# Altium project mppt.PrjPCB
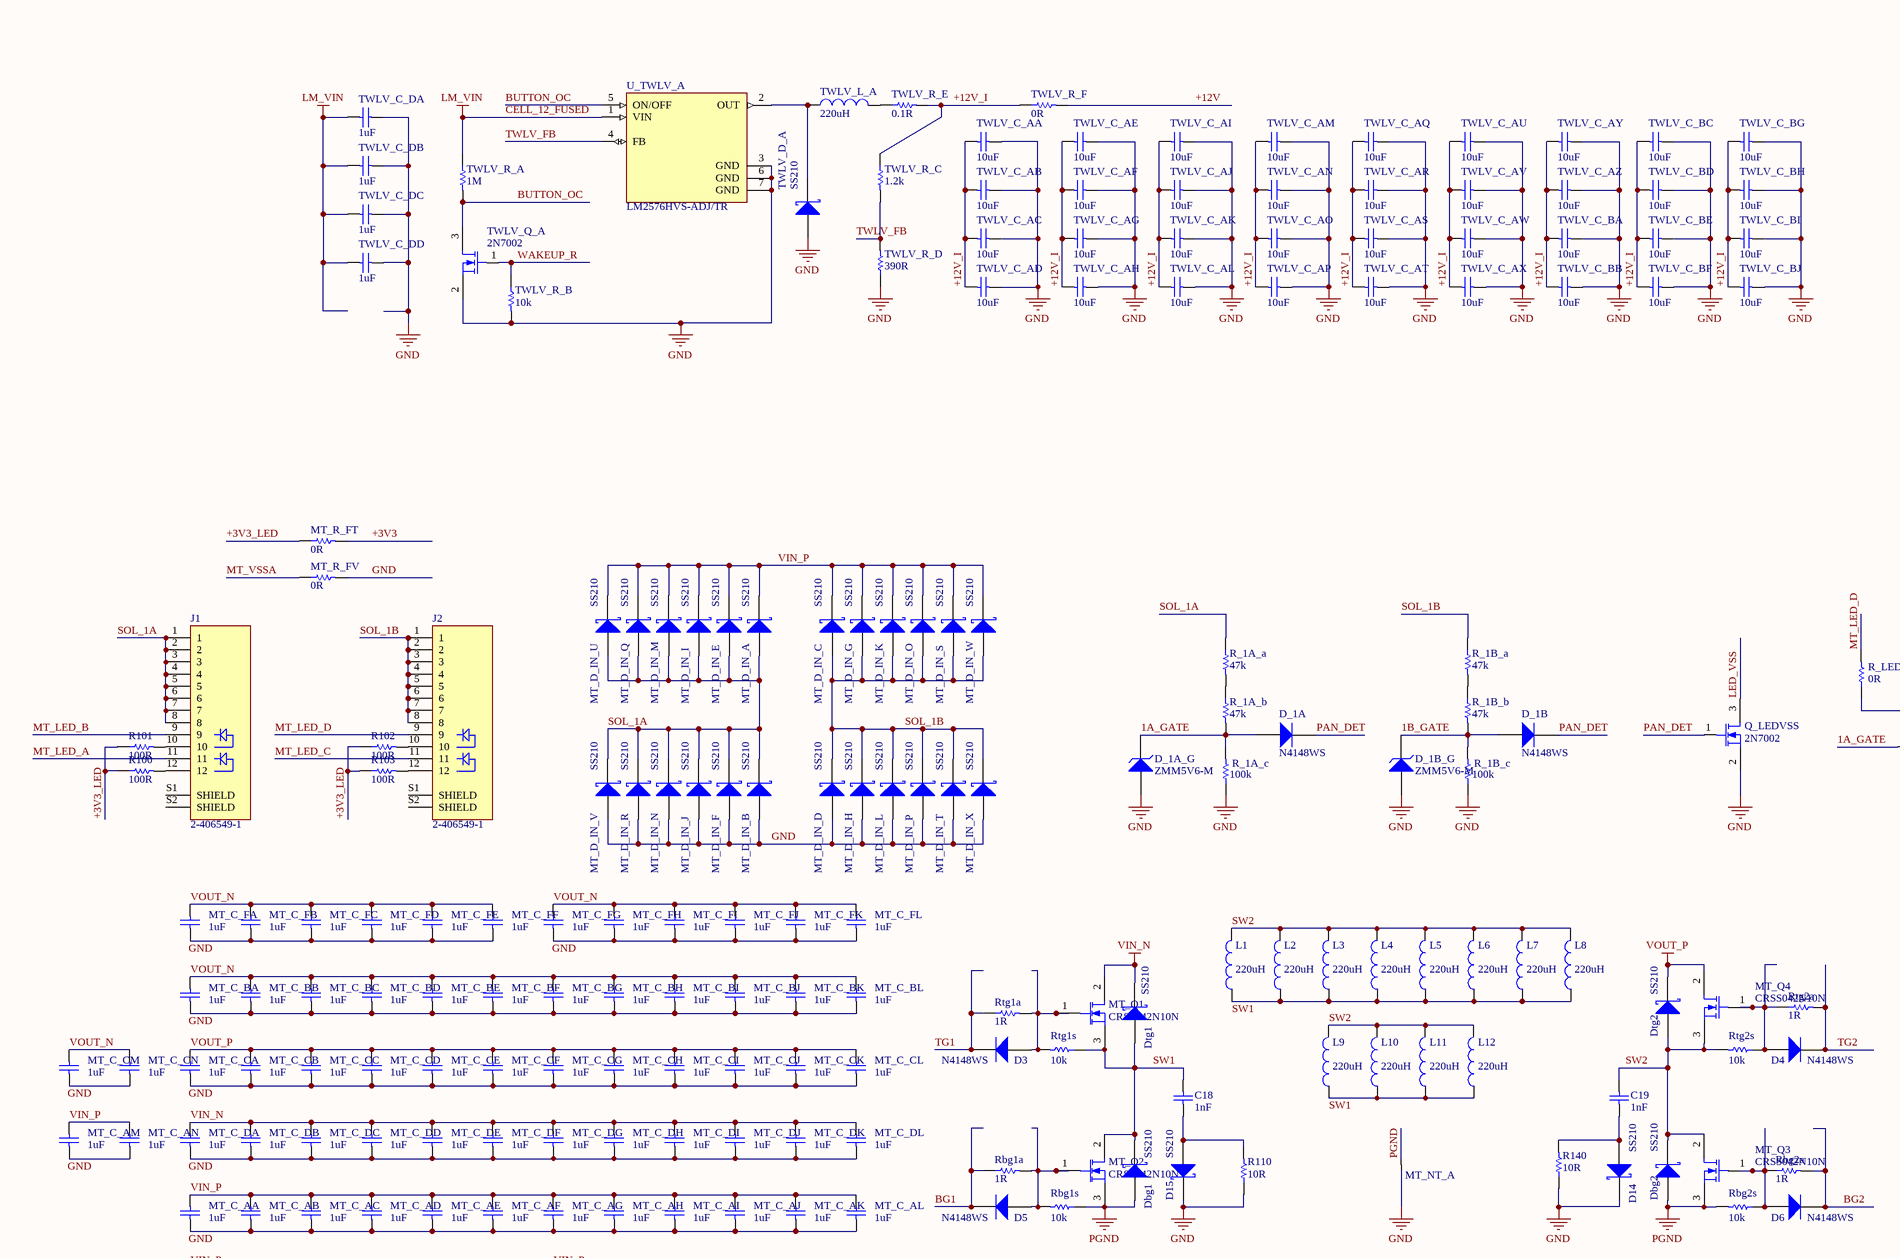
[diagram p0: mppt.SchDoc, top left]
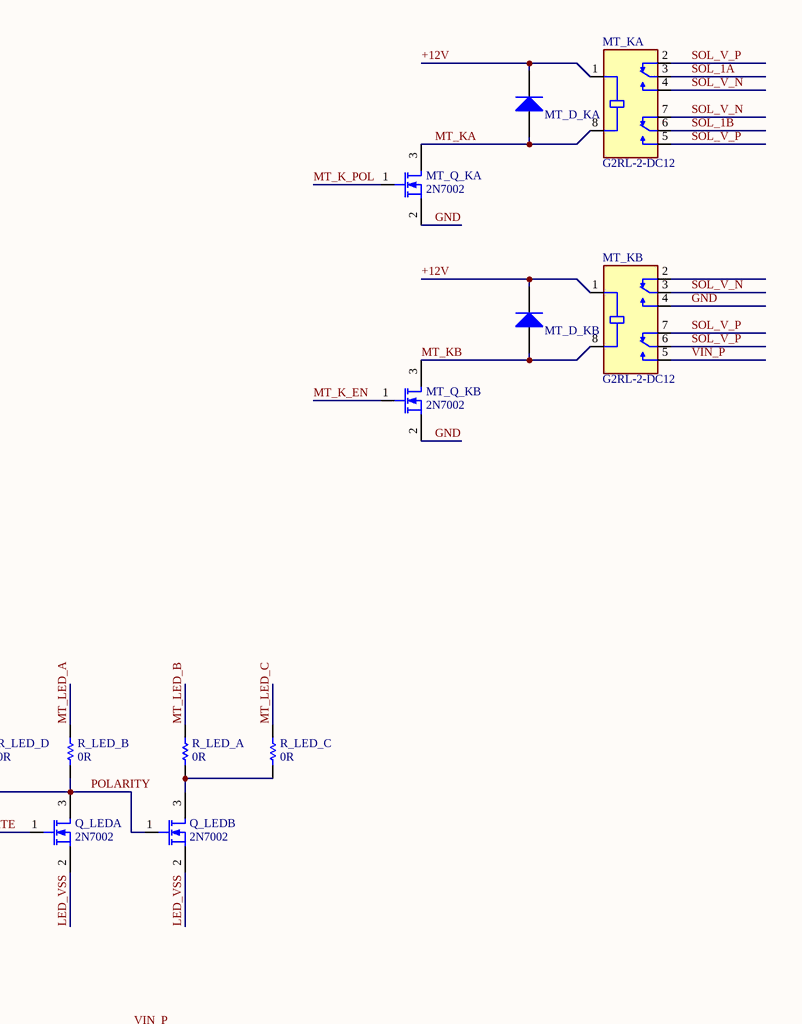
[diagram p1: mppt.SchDoc, top right]
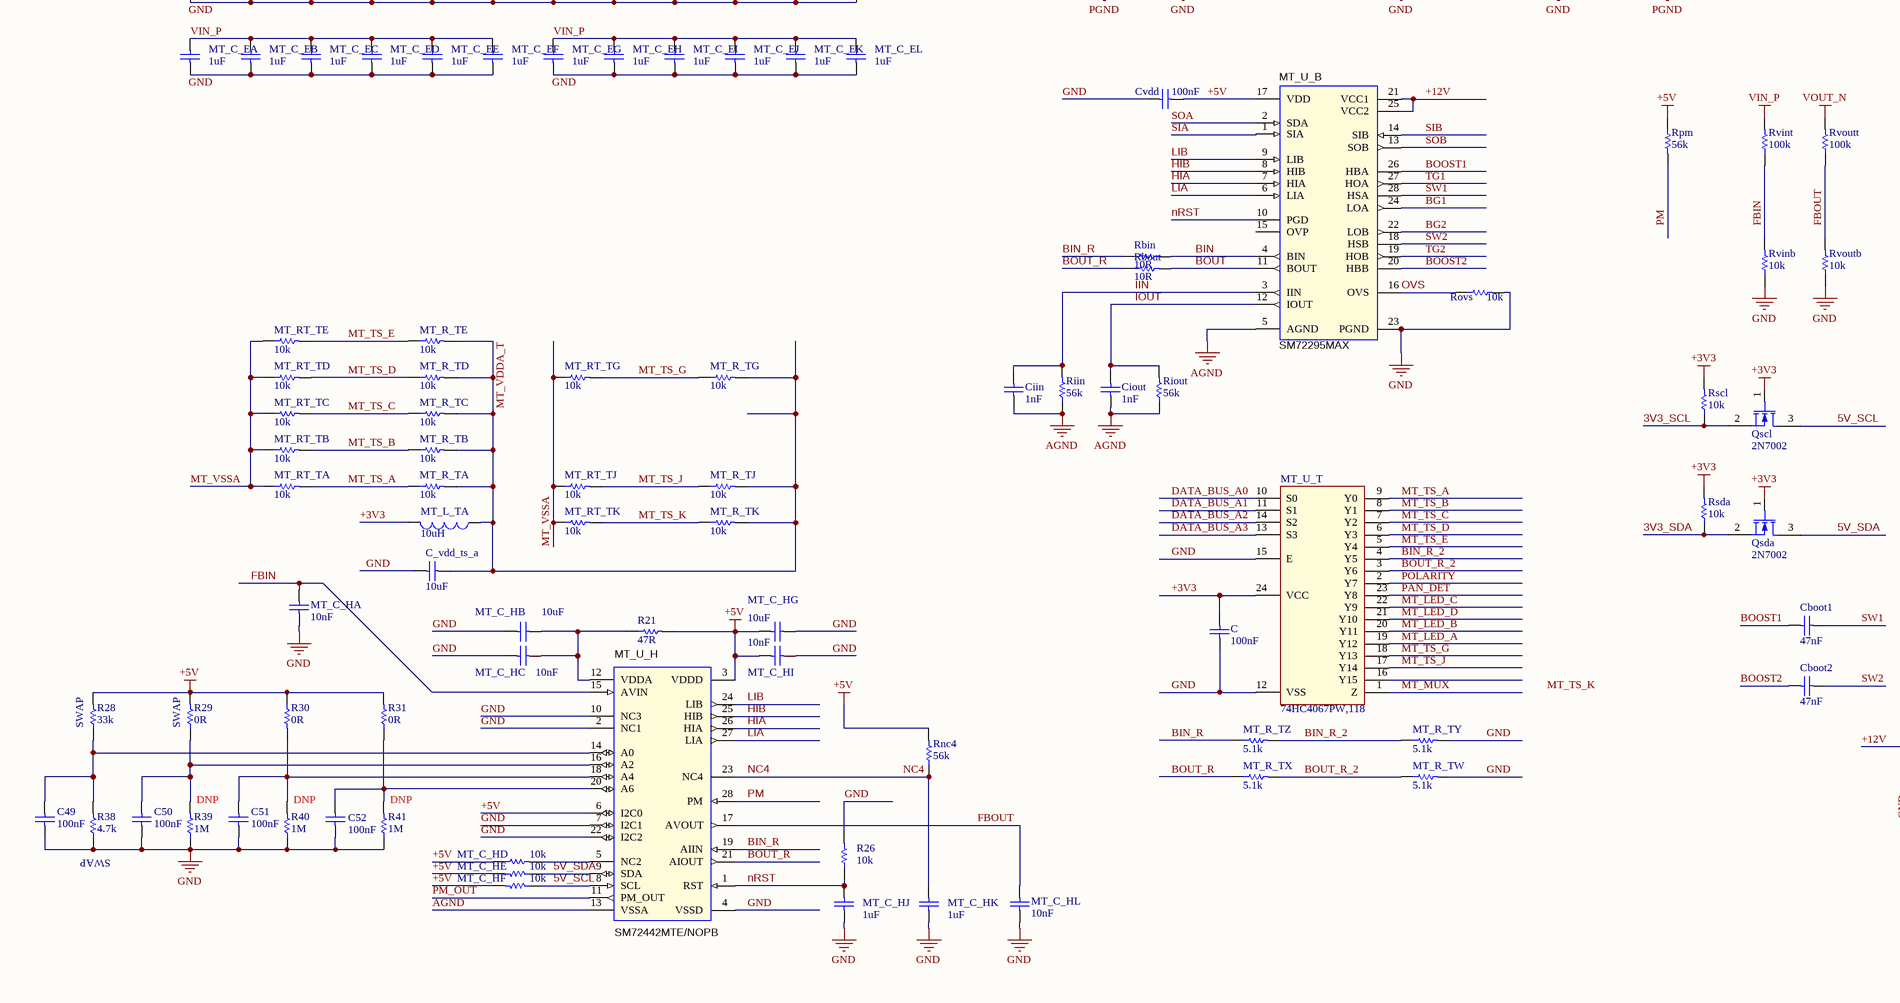
[diagram p2: mppt.SchDoc, bottom left]
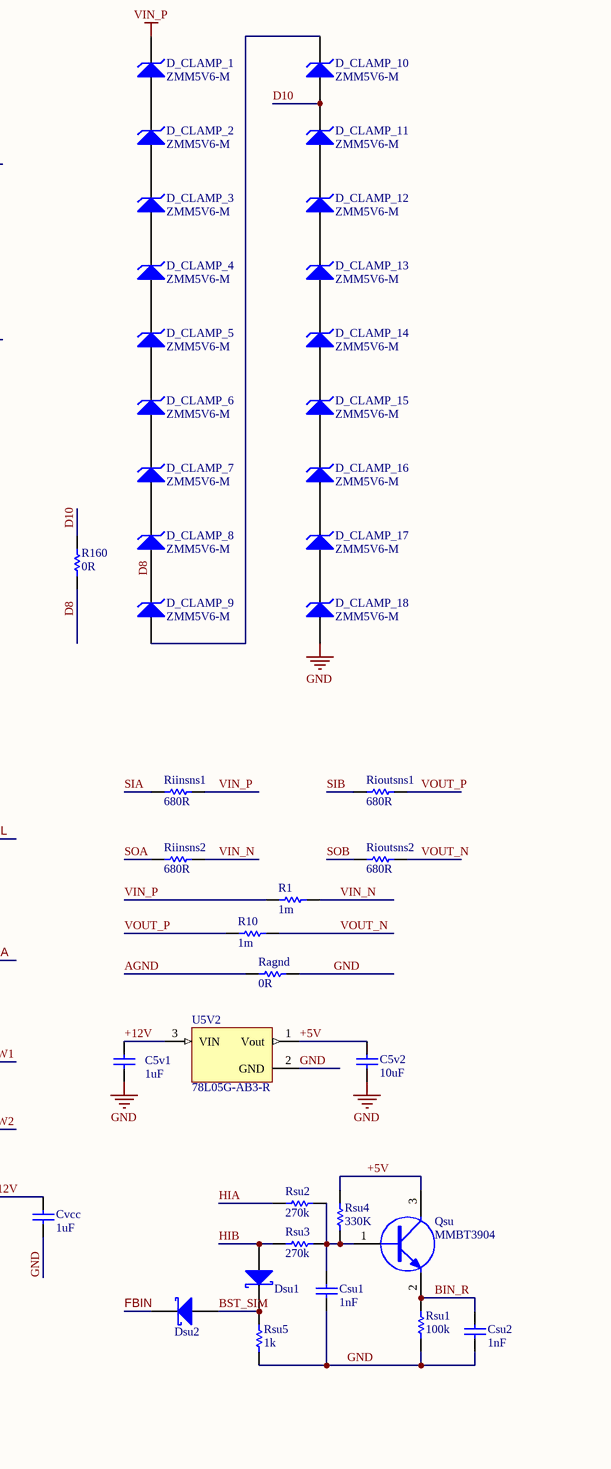
[diagram p3: mppt.SchDoc, bottom right]
PCB_CopperRev: 001; PCB_MinorRev: -001 REV A; PCB_SilkRev: REV A; PRJ_BasePN: 600556; PRJ_Customer: National Semiconductor; PRJ_Title: SM3320-BATT-EV; SCH_Rev: X1; TechSupport: http://www.national.com/support
1 sheet, 331 parts. Net scope: global (net labels, ports and power ports of the same name join across sheets).
Board file: mppt.PcbDoc

## Sheet mppt.SchDoc: ChangeMe
size D; Date: Not shown in title block; ApprovedBy: Not shown in title block; CheckedBy: Not shown in title block; Author: Not shown in title block; CompanyName: Not shown in title block; DrawnBy: Not shown in title block; Engineer: Not shown in title block; Organization: Not shown in title block; Address1: Not shown in title block; Address2: Not shown in title block; Address3: Not shown in title block; Address4: Not shown in title block; DocumentNumber: 1; Revision: Use project parameter SCH_Rev; SheetNumber: 1; SheetTotal: 1; PageSetup: Record=PageOptions|CenterHorizontal=True|CenterVertical=True|PrintScale=0.85|XCorrection=0.00|YCorrection=0.00|PrintKind=2|BorderSize=5000000|LeftOffset=0|BottomOffset=0|Orientation=2|PaperLength=1000|PaperWidth=1000|Scale=100|PaperSource=15|PrintQuality=600|MediaType=1|DitherType=10|PaperKind=11x17|PrintScaleMode=0; CurrentTime: Not shown in title block; CurrentDate: Not shown in title block; Time: Not shown in title block; DocumentFullPathAndName: Not shown in title block; DocumentName: Not shown in title block; ModifiedDate: Not shown in title block; ImagePath: Not shown in title block

### Parts
C  value 100nF  [C_0402]  (hidden comment: CL05B104KO5NNNC)
C5v1  value 1uF  [C_0402]  (hidden comment: CL05A105KA5NQNC)
C5v2  value 10uF  [C_0402]  (hidden comment: CL05A106MQ5NUNC)
C18  value 1nF  [C_1206]  (hidden comment: 1206B102K202NT)
C19  value 1nF  [C_1206]  (hidden comment: 1206B102K202NT)
C49  value 100nF  [C_0402]  (hidden comment: CL05B104KO5NNNC)
C50  value 100nF  [C_0402]  (hidden comment: CL05B104KO5NNNC)
C51  value 100nF  [C_0402]  (hidden comment: CL05B104KO5NNNC)
C52  value 100nF  [C_0402]  (hidden comment: CL05B104KO5NNNC)
C_vdd_ts_a  value 10uF  [C_0402]  (hidden comment: CL05A106MQ5NUNC)
Cboot1  value 47nF  [C_0603]  (hidden comment: CL10B474KA8NNNC)
Cboot2  value 47nF  [C_0603]  (hidden comment: CL10B474KA8NNNC)
Ciin  value 1nF  [C_0402]  (hidden comment: 0402B102K500NT)
Ciout  value 1nF  [C_0402]  (hidden comment: 0402B102K500NT)
Csu1  value 1nF  [C_0402]  (hidden comment: 0402B102K500NT)
Csu2  value 1nF  [C_0402]  (hidden comment: 0402B102K500NT)
Cvcc  value 1uF  [C_0402]  (hidden comment: CL05A105KA5NQNC)
Cvdd  value 100nF  [C_0402]  (hidden comment: CL05B104KO5NNNC)
D3  N4148WS  [SOD-323]
D4  N4148WS  [SOD-323]
D5  N4148WS  [SOD-323]
D6  N4148WS  [SOD-323]
D14  SS210  [DO-214AC]
D15  SS210  [DO-214AC]
D_1A  N4148WS  [SOD-323]
D_1A_G  ZMM5V6-M  [DO-213AA]
D_1B  N4148WS  [SOD-323]
D_1B_G  ZMM5V6-M  [DO-213AA]
D_CLAMP_1  ZMM5V6-M  [DO-213AA]
D_CLAMP_2  ZMM5V6-M  [DO-213AA]
D_CLAMP_3  ZMM5V6-M  [DO-213AA]
D_CLAMP_4  ZMM5V6-M  [DO-213AA]
D_CLAMP_5  ZMM5V6-M  [DO-213AA]
D_CLAMP_6  ZMM5V6-M  [DO-213AA]
D_CLAMP_7  ZMM5V6-M  [DO-213AA]
D_CLAMP_8  ZMM5V6-M  [DO-213AA]
D_CLAMP_9  ZMM5V6-M  [DO-213AA]
D_CLAMP_10  ZMM5V6-M  [DO-213AA]
D_CLAMP_11  ZMM5V6-M  [DO-213AA]
D_CLAMP_12  ZMM5V6-M  [DO-213AA]
D_CLAMP_13  ZMM5V6-M  [DO-213AA]
D_CLAMP_14  ZMM5V6-M  [DO-213AA]
D_CLAMP_15  ZMM5V6-M  [DO-213AA]
D_CLAMP_16  ZMM5V6-M  [DO-213AA]
D_CLAMP_17  ZMM5V6-M  [DO-213AA]
D_CLAMP_18  ZMM5V6-M  [DO-213AA]
Dbg1  SS210  [DO-214AC]
Dbg2  SS210  [DO-214AC]
Dsu1  1N5819WS  [SOD-323]  (value not drawn)
Dsu2  1N5819WS  [SOD-323]  (value not drawn)
Dtg1  SS210  [DO-214AC]
Dtg2  SS210  [DO-214AC]
J1  2-406549-1  [TE_2-406549-1]
J2  2-406549-1  [TE_2-406549-1]
L1  value 220uH  [SRR1260]  (hidden comment: SWRB1207S-221MT)
L2  value 220uH  [SRR1260]  (hidden comment: SWRB1207S-221MT)
L3  value 220uH  [SRR1260]  (hidden comment: SWRB1207S-221MT)
L4  value 220uH  [SRR1260]  (hidden comment: SWRB1207S-221MT)
L5  value 220uH  [SRR1260]  (hidden comment: SWRB1207S-221MT)
L6  value 220uH  [SRR1260]  (hidden comment: SWRB1207S-221MT)
L7  value 220uH  [SRR1260]  (hidden comment: SWRB1207S-221MT)
L8  value 220uH  [SRR1260]  (hidden comment: SWRB1207S-221MT)
L9  value 220uH  [SRR1260]  (hidden comment: SWRB1207S-221MT)
L10  value 220uH  [SRR1260]  (hidden comment: SWRB1207S-221MT)
L11  value 220uH  [SRR1260]  (hidden comment: SWRB1207S-221MT)
L12  value 220uH  [SRR1260]  (hidden comment: SWRB1207S-221MT)
MT_C_AA  value 1uF  [C_1206]  (hidden comment: 1206B105K101NT)
MT_C_AB  value 1uF  [C_1206]  (hidden comment: 1206B105K101NT)
MT_C_AC  value 1uF  [C_1206]  (hidden comment: 1206B105K101NT)
MT_C_AD  value 1uF  [C_1206]  (hidden comment: 1206B105K101NT)
MT_C_AE  value 1uF  [C_1206]  (hidden comment: 1206B105K101NT)
MT_C_AF  value 1uF  [C_1206]  (hidden comment: 1206B105K101NT)
MT_C_AG  value 1uF  [C_1206]  (hidden comment: 1206B105K101NT)
MT_C_AH  value 1uF  [C_1206]  (hidden comment: 1206B105K101NT)
MT_C_AI  value 1uF  [C_1206]  (hidden comment: 1206B105K101NT)
MT_C_AJ  value 1uF  [C_1206]  (hidden comment: 1206B105K101NT)
MT_C_AK  value 1uF  [C_1206]  (hidden comment: 1206B105K101NT)
MT_C_AL  value 1uF  [C_1206]  (hidden comment: 1206B105K101NT)
MT_C_AM  value 1uF  [C_1206]  (hidden comment: 1206B105K101NT)
MT_C_AN  value 1uF  [C_1206]  (hidden comment: 1206B105K101NT)
MT_C_BA  value 1uF  [C_1206]  (hidden comment: 1206B105K101NT)
MT_C_BB  value 1uF  [C_1206]  (hidden comment: 1206B105K101NT)
MT_C_BC  value 1uF  [C_1206]  (hidden comment: 1206B105K101NT)
MT_C_BD  value 1uF  [C_1206]  (hidden comment: 1206B105K101NT)
MT_C_BE  value 1uF  [C_1206]  (hidden comment: 1206B105K101NT)
MT_C_BF  value 1uF  [C_1206]  (hidden comment: 1206B105K101NT)
MT_C_BG  value 1uF  [C_1206]  (hidden comment: 1206B105K101NT)
MT_C_BH  value 1uF  [C_1206]  (hidden comment: 1206B105K101NT)
MT_C_BI  value 1uF  [C_1206]  (hidden comment: 1206B105K101NT)
MT_C_BJ  value 1uF  [C_1206]  (hidden comment: 1206B105K101NT)
MT_C_BK  value 1uF  [C_1206]  (hidden comment: 1206B105K101NT)
MT_C_BL  value 1uF  [C_1206]  (hidden comment: 1206B105K101NT)
MT_C_CA  value 1uF  [C_1206]  (hidden comment: 1206B105K101NT)
MT_C_CB  value 1uF  [C_1206]  (hidden comment: 1206B105K101NT)
MT_C_CC  value 1uF  [C_1206]  (hidden comment: 1206B105K101NT)
MT_C_CD  value 1uF  [C_1206]  (hidden comment: 1206B105K101NT)
MT_C_CE  value 1uF  [C_1206]  (hidden comment: 1206B105K101NT)
MT_C_CF  value 1uF  [C_1206]  (hidden comment: 1206B105K101NT)
MT_C_CG  value 1uF  [C_1206]  (hidden comment: 1206B105K101NT)
MT_C_CH  value 1uF  [C_1206]  (hidden comment: 1206B105K101NT)
MT_C_CI  value 1uF  [C_1206]  (hidden comment: 1206B105K101NT)
MT_C_CJ  value 1uF  [C_1206]  (hidden comment: 1206B105K101NT)
MT_C_CK  value 1uF  [C_1206]  (hidden comment: 1206B105K101NT)
MT_C_CL  value 1uF  [C_1206]  (hidden comment: 1206B105K101NT)
MT_C_CM  value 1uF  [C_1206]  (hidden comment: 1206B105K101NT)
MT_C_CN  value 1uF  [C_1206]  (hidden comment: 1206B105K101NT)
MT_C_DA  value 1uF  [C_1206]  (hidden comment: 1206B105K101NT)
MT_C_DB  value 1uF  [C_1206]  (hidden comment: 1206B105K101NT)
MT_C_DC  value 1uF  [C_1206]  (hidden comment: 1206B105K101NT)
MT_C_DD  value 1uF  [C_1206]  (hidden comment: 1206B105K101NT)
MT_C_DE  value 1uF  [C_1206]  (hidden comment: 1206B105K101NT)
MT_C_DF  value 1uF  [C_1206]  (hidden comment: 1206B105K101NT)
MT_C_DG  value 1uF  [C_1206]  (hidden comment: 1206B105K101NT)
MT_C_DH  value 1uF  [C_1206]  (hidden comment: 1206B105K101NT)
MT_C_DI  value 1uF  [C_1206]  (hidden comment: 1206B105K101NT)
MT_C_DJ  value 1uF  [C_1206]  (hidden comment: 1206B105K101NT)
MT_C_DK  value 1uF  [C_1206]  (hidden comment: 1206B105K101NT)
MT_C_DL  value 1uF  [C_1206]  (hidden comment: 1206B105K101NT)
MT_C_EA  value 1uF  [C_1206]  (hidden comment: 1206B105K101NT)
MT_C_EB  value 1uF  [C_1206]  (hidden comment: 1206B105K101NT)
MT_C_EC  value 1uF  [C_1206]  (hidden comment: 1206B105K101NT)
MT_C_ED  value 1uF  [C_1206]  (hidden comment: 1206B105K101NT)
MT_C_EE  value 1uF  [C_1206]  (hidden comment: 1206B105K101NT)
MT_C_EF  value 1uF  [C_1206]  (hidden comment: 1206B105K101NT)
MT_C_EG  value 1uF  [C_1206]  (hidden comment: 1206B105K101NT)
MT_C_EH  value 1uF  [C_1206]  (hidden comment: 1206B105K101NT)
MT_C_EI  value 1uF  [C_1206]  (hidden comment: 1206B105K101NT)
MT_C_EJ  value 1uF  [C_1206]  (hidden comment: 1206B105K101NT)
MT_C_EK  value 1uF  [C_1206]  (hidden comment: 1206B105K101NT)
MT_C_EL  value 1uF  [C_1206]  (hidden comment: 1206B105K101NT)
MT_C_FA  value 1uF  [C_1206]  (hidden comment: 1206B105K101NT)
MT_C_FB  value 1uF  [C_1206]  (hidden comment: 1206B105K101NT)
MT_C_FC  value 1uF  [C_1206]  (hidden comment: 1206B105K101NT)
MT_C_FD  value 1uF  [C_1206]  (hidden comment: 1206B105K101NT)
MT_C_FE  value 1uF  [C_1206]  (hidden comment: 1206B105K101NT)
MT_C_FF  value 1uF  [C_1206]  (hidden comment: 1206B105K101NT)
MT_C_FG  value 1uF  [C_1206]  (hidden comment: 1206B105K101NT)
MT_C_FH  value 1uF  [C_1206]  (hidden comment: 1206B105K101NT)
MT_C_FI  value 1uF  [C_1206]  (hidden comment: 1206B105K101NT)
MT_C_FJ  value 1uF  [C_1206]  (hidden comment: 1206B105K101NT)
MT_C_FK  value 1uF  [C_1206]  (hidden comment: 1206B105K101NT)
MT_C_FL  value 1uF  [C_1206]  (hidden comment: 1206B105K101NT)
MT_C_HA  value 10nF  [C_0402]  (hidden comment: CL05B103KB5NNNC)
MT_C_HB  value 10uF  [C_0402]  (hidden comment: CL05A106MQ5NUNC)
MT_C_HC  value 10nF  [C_0402]  (hidden comment: CL05B103KB5NNNC)
MT_C_HD  value 10k  [R_0402]  (hidden comment: 0402WGF1002TCE)
MT_C_HE  value 10k  [R_0402]  (hidden comment: 0402WGF1002TCE)
MT_C_HF  value 10k  [R_0402]  (hidden comment: 0402WGF1002TCE)
MT_C_HG  value 10uF  [C_0402]  (hidden comment: CL05A106MQ5NUNC)
MT_C_HI  value 10nF  [C_0402]  (hidden comment: CL05B103KB5NNNC)
MT_C_HJ  value 1uF  [C_0402]  (hidden comment: CL05A105KA5NQNC)
MT_C_HK  value 1uF  [C_0402]  (hidden comment: CL05A105KA5NQNC)
MT_C_HL  value 10nF  [C_0402]  (hidden comment: CL05B103KB5NNNC)
MT_D_IN_A  SS210  [DO-214AC]
MT_D_IN_B  SS210  [DO-214AC]
MT_D_IN_C  SS210  [DO-214AC]
MT_D_IN_D  SS210  [DO-214AC]
MT_D_IN_E  SS210  [DO-214AC]
MT_D_IN_F  SS210  [DO-214AC]
MT_D_IN_G  SS210  [DO-214AC]
MT_D_IN_H  SS210  [DO-214AC]
MT_D_IN_I  SS210  [DO-214AC]
MT_D_IN_J  SS210  [DO-214AC]
MT_D_IN_K  SS210  [DO-214AC]
MT_D_IN_L  SS210  [DO-214AC]
MT_D_IN_M  SS210  [DO-214AC]
MT_D_IN_N  SS210  [DO-214AC]
MT_D_IN_O  SS210  [DO-214AC]
MT_D_IN_P  SS210  [DO-214AC]
MT_D_IN_Q  SS210  [DO-214AC]
MT_D_IN_R  SS210  [DO-214AC]
MT_D_IN_S  SS210  [DO-214AC]
MT_D_IN_T  SS210  [DO-214AC]
MT_D_IN_U  SS210  [DO-214AC]
MT_D_IN_V  SS210  [DO-214AC]
MT_D_IN_W  SS210  [DO-214AC]
MT_D_IN_X  SS210  [DO-214AC]
MT_D_KA  1N4148WS  [SOD-323]  (value not drawn)
MT_D_KB  1N4148WS  [SOD-323]  (value not drawn)
MT_KA  G2RL-2-DC12  [RELAY_G2RL-2_12DC]
MT_KB  G2RL-2-DC12  [RELAY_G2RL-2_12DC]
MT_L_TA  value 10uH  [L_0603]  (hidden comment: SDFL1608S100KTF)
MT_NT_A  0  [NET_TIE]  (value not drawn)
MT_Q1  CRSS042N10N  [TO-263-3]
MT_Q2  CRSS042N10N  [TO-263-3]
MT_Q3  CRSS042N10N  [TO-263-3]
MT_Q4  CRSS042N10N  [TO-263-3]
MT_Q_KA  2N7002  [TO-236AB]
MT_Q_KB  2N7002  [TO-236AB]
MT_R_FT  value 0R  [R_0402]  (hidden comment: 0402WGF0000TCE)
MT_R_FV  value 0R  [R_0402]  (hidden comment: 0402WGF0000TCE)
MT_R_TA  value 10k  [R_0402]  (hidden comment: 0402WGF1002TCE)
MT_R_TB  value 10k  [R_0402]  (hidden comment: 0402WGF1002TCE)
MT_R_TC  value 10k  [R_0402]  (hidden comment: 0402WGF1002TCE)
MT_R_TD  value 10k  [R_0402]  (hidden comment: 0402WGF1002TCE)
MT_R_TE  value 10k  [R_0402]  (hidden comment: 0402WGF1002TCE)
MT_R_TG  value 10k  [R_0402]  (hidden comment: 0402WGF1002TCE)
MT_R_TJ  value 10k  [R_0402]  (hidden comment: 0402WGF1002TCE)
MT_R_TK  value 10k  [R_0402]  (hidden comment: 0402WGF1002TCE)
MT_R_TW  value 5.1k  [R_0402]  (hidden comment: 0402WGF5101TCE)
MT_R_TX  value 5.1k  [R_0402]  (hidden comment: 0402WGF5101TCE)
MT_R_TY  value 5.1k  [R_0402]  (hidden comment: 0402WGF5101TCE)
MT_R_TZ  value 5.1k  [R_0402]  (hidden comment: 0402WGF5101TCE)
MT_RT_TA  value 10k  [R_0402]  (hidden comment: NCP15XH103F03RC)
MT_RT_TB  value 10k  [R_0402]  (hidden comment: NCP15XH103F03RC)
MT_RT_TC  value 10k  [R_0402]  (hidden comment: NCP15XH103F03RC)
MT_RT_TD  value 10k  [R_0402]  (hidden comment: NCP15XH103F03RC)
MT_RT_TE  value 10k  [R_0402]  (hidden comment: NCP15XH103F03RC)
MT_RT_TG  value 10k  [R_0402]  (hidden comment: NCP15XH103F03RC)
MT_RT_TJ  value 10k  [R_0402]  (hidden comment: NCP15XH103F03RC)
MT_RT_TK  value 10k  [R_0402]  (hidden comment: NCP15XH103F03RC)
MT_U_B  SM72295MAX  [M28B_M]
MT_U_H  SM72442MTE/NOPB  [MTC28_L]
MT_U_T  74HC4067PW,118  [TSSOP-24-P0.65MM-W4.4MM]
Q_LEDA  2N7002  [TO-236AB]
Q_LEDB  2N7002  [TO-236AB]
Q_LEDVSS  2N7002  [TO-236AB]
Qscl  2N7002  [TO-236AB]
Qsda  2N7002  [TO-236AB]
Qsu  MMBT3904  [TO-236AB]
R1  1m  [R_2512]
R10  1m  [R_2512]
R21  value 47R  [R_0402]  (hidden comment: 0402WGF470JTCE)
R26  value 10k  [R_0402]  (hidden comment: 0402WGF1002TCE)
R28  value 33k  [R_0402]  (hidden comment: 0402WGF3302TCE)
R29  value 0R  [R_0402]  (hidden comment: 0402WGF0000TCE)
R30  value 0R  [R_0402]  (hidden comment: 0402WGF0000TCE)
R31  value 0R  [R_0402]  (hidden comment: 0402WGF0000TCE)
R38  value 4.7k  [R_0402]  (hidden comment: 0402WGF4701TCE)
R39  value 1M  [R_0402]  (hidden comment: 0402WGF1004TCE)
R40  value 1M  [R_0402]  (hidden comment: 0402WGF1004TCE)
R41  value 1M  [R_0402]  (hidden comment: 0402WGF1004TCE)
R100  value 100R  [R_0402]  (hidden comment: 0402WGF1000TCE)
R101  value 100R  [R_0402]  (hidden comment: 0402WGF1000TCE)
R102  value 100R  [R_0402]  (hidden comment: 0402WGF1000TCE)
R103  value 100R  [R_0402]  (hidden comment: 0402WGF1000TCE)
R110  value 10R  [R_1206]  (hidden comment: 1206W4F100JT5E)
R140  value 10R  [R_1206]  (hidden comment: 1206W4F100JT5E)
R160  value 0R  [R_0402]  (hidden comment: 0402WGF0000TCE)
R_1A_a  value 47k  [R_0402]  (hidden comment: 0402WGF4702TCE)
R_1A_b  value 47k  [R_0402]  (hidden comment: 0402WGF4702TCE)
R_1A_c  value 100k  [R_0402]  (hidden comment: 0402WGF1003TCE)
R_1B_a  value 47k  [R_0402]  (hidden comment: 0402WGF4702TCE)
R_1B_b  value 47k  [R_0402]  (hidden comment: 0402WGF4702TCE)
R_1B_c  value 100k  [R_0402]  (hidden comment: 0402WGF1003TCE)
R_LED_A  value 0R  [R_0402]  (hidden comment: 0402WGF0000TCE)
R_LED_B  value 0R  [R_0402]  (hidden comment: 0402WGF0000TCE)
R_LED_C  value 0R  [R_0402]  (hidden comment: 0402WGF0000TCE)
R_LED_D  value 0R  [R_0402]  (hidden comment: 0402WGF0000TCE)
Ragnd  value 0R  [R_0402]  (hidden comment: 0402WGF0000TCE)
Rbg1a  value 1R  [R_0603]  (hidden comment: 0603WAF100KT5E)
Rbg1s  value 10k  [R_0402]  (hidden comment: 0402WGF1002TCE)
Rbg2a  value 1R  [R_0603]  (hidden comment: 0603WAF100KT5E)
Rbg2s  value 10k  [R_0402]  (hidden comment: 0402WGF1002TCE)
Rbin  value 10R  [R_0402]  (hidden comment: 0402WGF100JTCE)
Rbout  value 10R  [R_0402]  (hidden comment: 0402WGF100JTCE)
Riin  value 56k  [R_0402]  (hidden comment: 0402WGF5602TCE)
Riinsns1  value 680R  [R_0603]  (hidden comment: 0603WAF6800T5E)
Riinsns2  value 680R  [R_0603]  (hidden comment: 0603WAF6800T5E)
Riout  value 56k  [R_0402]  (hidden comment: 0402WGF5602TCE)
Rioutsns1  value 680R  [R_0603]  (hidden comment: 0603WAF6800T5E)
Rioutsns2  value 680R  [R_0603]  (hidden comment: 0603WAF6800T5E)
Rnc4  value 56k  [R_0402]  (hidden comment: 0402WGF5602TCE)
Rovs  value 10k  [R_0402]  (hidden comment: 0402WGF1002TCE)
Rpm  value 56k  [R_0402]  (hidden comment: 0402WGF5602TCE)
Rscl  value 10k  [R_0402]  (hidden comment: 0402WGF1002TCE)
Rsda  value 10k  [R_0402]  (hidden comment: 0402WGF1002TCE)
Rsu1  value 100k  [R_0402]  (hidden comment: 0402WGF1003TCE)
Rsu2  value 270k  [R_0603]  (hidden comment: 0603WAF2703T5E)
Rsu3  value 270k  [R_0603]  (hidden comment: 0603WAF2703T5E)
Rsu4  value 330K  [R_0402]  (hidden comment: 0402WGF3303TCE)
Rsu5  value 1k  [R_0402]  (hidden comment: 0402WGF1001TCE)
Rtg1a  value 1R  [R_0603]  (hidden comment: 0603WAF100KT5E)
Rtg1s  value 10k  [R_0402]  (hidden comment: 0402WGF1002TCE)
Rtg2a  value 1R  [R_0603]  (hidden comment: 0603WAF100KT5E)
Rtg2s  value 10k  [R_0402]  (hidden comment: 0402WGF1002TCE)
Rvinb  value 10k  [R_0603]  (hidden comment: 0603WAF1002T5E)
Rvint  value 100k  [R_0603]  (hidden comment: 0603WAF1003T5E)
Rvoutb  value 10k  [R_0603]  (hidden comment: 0603WAF1002T5E)
Rvoutt  value 100k  [R_0603]  (hidden comment: 0603WAF1003T5E)
TWLV_C_AA  value 10uF  [C_0603]  (hidden comment: CL10A106MA8NRNC)
TWLV_C_AB  value 10uF  [C_0603]  (hidden comment: CL10A106MA8NRNC)
TWLV_C_AC  value 10uF  [C_0603]  (hidden comment: CL10A106MA8NRNC)
TWLV_C_AD  value 10uF  [C_0603]  (hidden comment: CL10A106MA8NRNC)
TWLV_C_AE  value 10uF  [C_0603]  (hidden comment: CL10A106MA8NRNC)
TWLV_C_AF  value 10uF  [C_0603]  (hidden comment: CL10A106MA8NRNC)
TWLV_C_AG  value 10uF  [C_0603]  (hidden comment: CL10A106MA8NRNC)
TWLV_C_AH  value 10uF  [C_0603]  (hidden comment: CL10A106MA8NRNC)
TWLV_C_AI  value 10uF  [C_0603]  (hidden comment: CL10A106MA8NRNC)
TWLV_C_AJ  value 10uF  [C_0603]  (hidden comment: CL10A106MA8NRNC)
TWLV_C_AK  value 10uF  [C_0603]  (hidden comment: CL10A106MA8NRNC)
TWLV_C_AL  value 10uF  [C_0603]  (hidden comment: CL10A106MA8NRNC)
TWLV_C_AM  value 10uF  [C_0603]  (hidden comment: CL10A106MA8NRNC)
TWLV_C_AN  value 10uF  [C_0603]  (hidden comment: CL10A106MA8NRNC)
TWLV_C_AO  value 10uF  [C_0603]  (hidden comment: CL10A106MA8NRNC)
TWLV_C_AP  value 10uF  [C_0603]  (hidden comment: CL10A106MA8NRNC)
TWLV_C_AQ  value 10uF  [C_0603]  (hidden comment: CL10A106MA8NRNC)
TWLV_C_AR  value 10uF  [C_0603]  (hidden comment: CL10A106MA8NRNC)
TWLV_C_AS  value 10uF  [C_0603]  (hidden comment: CL10A106MA8NRNC)
TWLV_C_AT  value 10uF  [C_0603]  (hidden comment: CL10A106MA8NRNC)
TWLV_C_AU  value 10uF  [C_0603]  (hidden comment: CL10A106MA8NRNC)
TWLV_C_AV  value 10uF  [C_0603]  (hidden comment: CL10A106MA8NRNC)
TWLV_C_AW  value 10uF  [C_0603]  (hidden comment: CL10A106MA8NRNC)
TWLV_C_AX  value 10uF  [C_0603]  (hidden comment: CL10A106MA8NRNC)
TWLV_C_AY  value 10uF  [C_0603]  (hidden comment: CL10A106MA8NRNC)
TWLV_C_AZ  value 10uF  [C_0603]  (hidden comment: CL10A106MA8NRNC)
TWLV_C_BA  value 10uF  [C_0603]  (hidden comment: CL10A106MA8NRNC)
TWLV_C_BB  value 10uF  [C_0603]  (hidden comment: CL10A106MA8NRNC)
TWLV_C_BC  value 10uF  [C_0603]  (hidden comment: CL10A106MA8NRNC)
TWLV_C_BD  value 10uF  [C_0603]  (hidden comment: CL10A106MA8NRNC)
TWLV_C_BE  value 10uF  [C_0603]  (hidden comment: CL10A106MA8NRNC)
TWLV_C_BF  value 10uF  [C_0603]  (hidden comment: CL10A106MA8NRNC)
TWLV_C_BG  value 10uF  [C_0603]  (hidden comment: CL10A106MA8NRNC)
TWLV_C_BH  value 10uF  [C_0603]  (hidden comment: CL10A106MA8NRNC)
TWLV_C_BI  value 10uF  [C_0603]  (hidden comment: CL10A106MA8NRNC)
TWLV_C_BJ  value 10uF  [C_0603]  (hidden comment: CL10A106MA8NRNC)
TWLV_C_DA  value 1uF  [C_1206]  (hidden comment: 1206B105K101NT)
TWLV_C_DB  value 1uF  [C_1206]  (hidden comment: 1206B105K101NT)
TWLV_C_DC  value 1uF  [C_1206]  (hidden comment: 1206B105K101NT)
TWLV_C_DD  value 1uF  [C_1206]  (hidden comment: 1206B105K101NT)
TWLV_D_A  SS210  [DO-214AC]
TWLV_L_A  value 220uH  [SRR1260]  (hidden comment: SWRB1207S-221MT)
TWLV_Q_A  2N7002  [TO-236AB]
TWLV_R_A  value 1M  [R_0402]  (hidden comment: 0402WGF1004TCE)
TWLV_R_B  value 10k  [R_0402]  (hidden comment: 0402WGF1002TCE)
TWLV_R_C  value 1.2k  [R_0402]  (hidden comment: 0402WGF1201TCE)
TWLV_R_D  value 390R  [R_0603]  (hidden comment: 0603WAF3900T5E)
TWLV_R_E  value 0.1R  [R_1206]  (hidden comment: 1206W4F100LT5E)
TWLV_R_F  value 0R  [R_0402]  (hidden comment: 0402WGF0000TCE)
U5V2  78L05G-AB3-R  [SOT-223-3]
U_TWLV_A  LM2576HVS-ADJ/TR  [TO-263-5]

### Nets
+3V3: C.2 MT_L_TA.2 MT_R_FT.2 MT_U_T.24(VCC) Qscl.1(G) Qsda.1(G) Rscl.2 Rsda.2
+5V: C5v2.2 Cvdd.2 MT_C_HD.1 MT_C_HE.2 MT_C_HF.2 MT_C_HG.2 MT_C_HI.1 MT_U_B.17(VDD) MT_U_H.3(VDDD) MT_U_H.6(I2C0) Qsu.3(C) R21.2 R28.2 R29.2 R30.1 R31.2 Rnc4.2 Rpm.1 Rsu4.2 U5V2.1(Vout)
AGND: Ciin.1 Ciout.1 MT_U_B.5(AGND) MT_U_H.13(VSSA) Ragnd.2 Riin.1 Riout.1
CELL_12_FUSED: TWLV_C_DA.1 TWLV_C_DB.1 TWLV_C_DC.1 TWLV_C_DD.1 TWLV_R_A.1 U_TWLV_A.1(VIN)  [also labelled LM_VIN]
GND: C.1 C5v1.1 C5v2.1 C49.1 C50.1 C51.1 C52.2 C_vdd_ts_a.2 Csu1.1 Csu2.1 Cvcc.1 Cvdd.1 D14.1(K) D15.1(K) D_1A_G.2(A) D_1B_G.2(A) D_CLAMP_18.2(A) MT_C_AA.1 MT_C_AB.1 MT_C_AC.1 MT_C_AD.1 MT_C_AE.1 MT_C_AF.1 MT_C_AG.1 MT_C_AH.1 MT_C_AI.1 MT_C_AJ.1 MT_C_AK.1 MT_C_AL.1 MT_C_AM.1 MT_C_AN.1 MT_C_BA.1 MT_C_BB.1 MT_C_BC.1 MT_C_BD.1 MT_C_BE.1 MT_C_BF.1 MT_C_BG.1 MT_C_BH.1 MT_C_BI.1 MT_C_BJ.1 MT_C_BK.1 MT_C_BL.1 MT_C_CA.1 MT_C_CB.1 MT_C_CC.1 MT_C_CD.1 MT_C_CE.1 MT_C_CF.1 MT_C_CG.1 MT_C_CH.1 MT_C_CI.1 MT_C_CJ.1 MT_C_CK.1 MT_C_CL.1 MT_C_CM.1 MT_C_CN.1 MT_C_DA.1 MT_C_DB.1 MT_C_DC.1 MT_C_DD.1 MT_C_DE.1 MT_C_DF.1 MT_C_DG.1 MT_C_DH.1 MT_C_DI.1 MT_C_DJ.1 MT_C_DK.1 MT_C_DL.1 MT_C_EA.1 MT_C_EB.1 MT_C_EC.1 MT_C_ED.1 MT_C_EE.1 MT_C_EF.1 MT_C_EG.1 MT_C_EH.1 MT_C_EI.1 MT_C_EJ.1 MT_C_EK.1 MT_C_EL.1 MT_C_FA.1 MT_C_FB.1 MT_C_FC.1 MT_C_FD.1 MT_C_FE.1 MT_C_FF.1 MT_C_FG.1 MT_C_FH.1 MT_C_FI.1 MT_C_FJ.1 MT_C_FK.1 MT_C_FL.1 MT_C_HA.1 MT_C_HB.2 MT_C_HC.1 MT_C_HG.1 MT_C_HI.2 MT_C_HJ.1 MT_C_HK.1 MT_C_HL.1 MT_D_IN_B.2(A) MT_D_IN_D.2(A) MT_D_IN_F.2(A) MT_D_IN_H.2(A) MT_D_IN_J.2(A) MT_D_IN_L.2(A) MT_D_IN_N.2(A) MT_D_IN_P.2(A) MT_D_IN_R.2(A) MT_D_IN_T.2(A) MT_D_IN_V.2(A) MT_D_IN_X.2(A) MT_KB.4(NO1) MT_NT_A.1 MT_Q_KA.2(S) MT_Q_KB.2(S) MT_R_FV.2 MT_R_TW.2 MT_R_TY.2 MT_U_B.23(PGND) MT_U_H.2(NC1) MT_U_H.4(VSSD) MT_U_H.7(I2C1) MT_U_H.10(NC3) MT_U_H.22(I2C2) MT_U_T.12(VSS) MT_U_T.15(E) Q_LEDVSS.2(S) R26.2 R38.1 R39.1 R40.1 R41.1 R110.1 R140.1 R_1A_c.1 R_1B_c.1 Ragnd.1 Rovs.2 Rsu1.1 Rsu5.2 Rvinb.1 Rvoutb.1 TWLV_C_AA.2 TWLV_C_AB.2 TWLV_C_AC.2 TWLV_C_AD.2 TWLV_C_AE.2 TWLV_C_AF.2 TWLV_C_AG.2 TWLV_C_AH.2 TWLV_C_AI.2 TWLV_C_AJ.2 TWLV_C_AK.2 TWLV_C_AL.2 TWLV_C_AM.2 TWLV_C_AN.2 TWLV_C_AO.2 TWLV_C_AP.2 TWLV_C_AQ.2 TWLV_C_AR.2 TWLV_C_AS.2 TWLV_C_AT.2 TWLV_C_AU.2 TWLV_C_AV.2 TWLV_C_AW.2 TWLV_C_AX.2 TWLV_C_AY.2 TWLV_C_AZ.2 TWLV_C_BA.2 TWLV_C_BB.2 TWLV_C_BC.2 TWLV_C_BD.2 TWLV_C_BE.2 TWLV_C_BF.2 TWLV_C_BG.2 TWLV_C_BH.2 TWLV_C_BI.2 TWLV_C_BJ.2 TWLV_C_DA.2 TWLV_C_DB.2 TWLV_C_DC.2 TWLV_C_DD.2 TWLV_D_A.2(A) TWLV_Q_A.2(S) TWLV_R_B.2 TWLV_R_D.1 U5V2.2(GND) U_TWLV_A.3(GND) U_TWLV_A.6(GND) U_TWLV_A.7(GND)
PGND: Dbg1.2(A) Dbg2.2(A) MT_NT_A.2 MT_Q2.3(S) MT_Q3.3(S) Rbg1s.1 Rbg2s.2
VIN_N: Dtg1.1(K) MT_C_DA.2 MT_C_DB.2 MT_C_DC.2 MT_C_DD.2 MT_C_DE.2 MT_C_DF.2 MT_C_DG.2 MT_C_DH.2 MT_C_DI.2 MT_C_DJ.2 MT_C_DK.2 MT_C_DL.2 MT_Q1.2(D) R1.1 Riinsns2.2
VIN_P: D_CLAMP_1.1(K) MT_C_AA.2 MT_C_AB.2 MT_C_AC.2 MT_C_AD.2 MT_C_AE.2 MT_C_AF.2 MT_C_AG.2 MT_C_AH.2 MT_C_AI.2 MT_C_AJ.2 MT_C_AK.2 MT_C_AL.2 MT_C_AM.2 MT_C_AN.2 MT_C_EA.2 MT_C_EB.2 MT_C_EC.2 MT_C_ED.2 MT_C_EE.2 MT_C_EF.2 MT_C_EG.2 MT_C_EH.2 MT_C_EI.2 MT_C_EJ.2 MT_C_EK.2 MT_C_EL.2 MT_D_IN_A.1(K) MT_D_IN_C.1(K) MT_D_IN_E.1(K) MT_D_IN_G.1(K) MT_D_IN_I.1(K) MT_D_IN_K.1(K) MT_D_IN_M.1(K) MT_D_IN_O.1(K) MT_D_IN_Q.1(K) MT_D_IN_S.1(K) MT_D_IN_U.1(K) MT_D_IN_W.1(K) MT_KB.5(NO2) R1.2 Riinsns1.2 Rvint.2
VOUT_N: MT_C_BA.2 MT_C_BB.2 MT_C_BC.2 MT_C_BD.2 MT_C_BE.2 MT_C_BF.2 MT_C_BG.2 MT_C_BH.2 MT_C_BI.2 MT_C_BJ.2 MT_C_BK.2 MT_C_BL.2 MT_C_CM.2 MT_C_CN.2 MT_C_FA.2 MT_C_FB.2 MT_C_FC.2 MT_C_FD.2 MT_C_FE.2 MT_C_FF.2 MT_C_FG.2 MT_C_FH.2 MT_C_FI.2 MT_C_FJ.2 MT_C_FK.2 MT_C_FL.2 R10.2 Rioutsns2.2 Rvoutt.2
VOUT_P: Dtg2.1(K) MT_C_CA.2 MT_C_CB.2 MT_C_CC.2 MT_C_CD.2 MT_C_CE.2 MT_C_CF.2 MT_C_CG.2 MT_C_CH.2 MT_C_CI.2 MT_C_CJ.2 MT_C_CK.2 MT_C_CL.2 MT_Q4.2(D) R10.1 Rioutsns1.2
1A_GATE: D_1A.2(A) D_1A_G.1(K) Q_LEDA.1(G) R_1A_b.2 R_1A_c.2
1B_GATE: D_1B.2(A) D_1B_G.1(K) R_1B_b.2 R_1B_c.2
3V3_SCL: Qscl.2(S) Rscl.1
3V3_SDA: Qsda.2(S) Rsda.1
5V_SCL: MT_C_HF.1 MT_U_H.8(SCL) Qscl.3(D)
5V_SDA: MT_C_HE.1 MT_U_H.9(SDA) Qsda.3(D)
+3V3_LED: MT_R_FT.1 R100.1 R101.1 R102.1 R103.1
+12V: C5v1.2 Cvcc.2 MT_D_KA.1(K) MT_D_KB.1(K) MT_KA.1(COIL1) MT_KB.1(COIL1) MT_U_B.21(VCC1) MT_U_B.25(VCC2) TWLV_R_F.2 U5V2.3(VIN)
+12V_I: TWLV_C_AA.1 TWLV_C_AB.1 TWLV_C_AC.1 TWLV_C_AD.1 TWLV_C_AE.1 TWLV_C_AF.1 TWLV_C_AG.1 TWLV_C_AH.1 TWLV_C_AI.1 TWLV_C_AJ.1 TWLV_C_AK.1 TWLV_C_AL.1 TWLV_C_AM.1 TWLV_C_AN.1 TWLV_C_AO.1 TWLV_C_AP.1 TWLV_C_AQ.1 TWLV_C_AR.1 TWLV_C_AS.1 TWLV_C_AT.1 TWLV_C_AU.1 TWLV_C_AV.1 TWLV_C_AW.1 TWLV_C_AX.1 TWLV_C_AY.1 TWLV_C_AZ.1 TWLV_C_BA.1 TWLV_C_BB.1 TWLV_C_BC.1 TWLV_C_BD.1 TWLV_C_BE.1 TWLV_C_BF.1 TWLV_C_BG.1 TWLV_C_BH.1 TWLV_C_BI.1 TWLV_C_BJ.1 TWLV_R_C.1 TWLV_R_E.2 TWLV_R_F.1
BG1: D5.1(K) MT_U_B.24(LOA) Rbg1a.1
BG2: D6.1(K) MT_U_B.22(LOB) Rbg2a.2
BIN: MT_U_B.4(BIN) Rbin.2
BIN_R: Csu2.2 MT_R_TZ.1 MT_U_H.19(AIIN) Qsu.2(E) Rbin.1 Rsu1.2
BIN_R_2: MT_R_TY.1 MT_R_TZ.2 MT_U_T.4(Y5)
BOOST1: Cboot1.2 MT_U_B.26(HBA)
BOOST2: Cboot2.2 MT_U_B.20(HBB)
BOUT: MT_U_B.11(BOUT) Rbout.2
BOUT_R: MT_R_TX.1 MT_U_H.21(AIOUT) Rbout.1
BOUT_R_2: MT_R_TW.1 MT_R_TX.2 MT_U_T.3(Y6)
BST_SIM: Dsu1.1(K) Dsu2.2(A) Rsu5.1
BUTTON_OC: TWLV_Q_A.3(D) TWLV_R_A.2 U_TWLV_A.5(ON/OFF)
D8: D_CLAMP_8.2(A) D_CLAMP_9.1(K) R160.1
D10: D_CLAMP_10.2(A) D_CLAMP_11.1(K) R160.2
DATA_BUS_A0: MT_U_T.10(S0)
DATA_BUS_A1: MT_U_T.11(S1)
DATA_BUS_A2: MT_U_T.14(S2)
DATA_BUS_A3: MT_U_T.13(S3)
FBIN: Dsu2.1(K) MT_C_HA.2 MT_U_H.15(AVIN) Rvinb.2 Rvint.1
FBOUT: MT_C_HL.2 MT_U_H.17(AVOUT) Rvoutb.2 Rvoutt.1
HIA: MT_U_B.7(HIA) MT_U_H.26(HIA) Rsu2.2
HIB: Dsu1.2(A) MT_U_B.8(HIB) MT_U_H.25(HIB) Rsu3.2
IIN: Ciin.2 MT_U_B.3(IIN) Riin.2
IOUT: Ciout.2 MT_U_B.12(IOUT) Riout.2
LED_VSS: Q_LEDA.2(S) Q_LEDB.2(S) Q_LEDVSS.3(D)
LIA: MT_U_B.6(LIA) MT_U_H.27(LIA)
LIB: MT_U_B.9(LIB) MT_U_H.24(LIB)
MT_K_EN: MT_Q_KB.1(G)
MT_K_POL: MT_Q_KA.1(G)
MT_KA: MT_D_KA.2(A) MT_KA.8(COIL2) MT_Q_KA.3(D)
MT_KB: MT_D_KB.2(A) MT_KB.8(COIL2) MT_Q_KB.3(D)
MT_LED_A: J1.11 MT_U_T.19(Y12) R_LED_B.2
MT_LED_B: J1.9 MT_U_T.20(Y11) R_LED_A.2
MT_LED_C: J2.11 MT_U_T.22(Y9) R_LED_C.2
MT_LED_D: J2.9 MT_U_T.21(Y10) R_LED_D.2
MT_MUX: MT_U_T.1(Z)
MT_TS_A: MT_R_TA.1 MT_RT_TA.2 MT_U_T.9(Y0)
MT_TS_B: MT_R_TB.1 MT_RT_TB.2 MT_U_T.8(Y1)
MT_TS_C: MT_R_TC.1 MT_RT_TC.2 MT_U_T.7(Y2)
MT_TS_D: MT_R_TD.1 MT_RT_TD.2 MT_U_T.6(Y3)
MT_TS_E: MT_R_TE.1 MT_RT_TE.2 MT_U_T.5(Y4)
MT_TS_G: MT_R_TG.1 MT_RT_TG.2 MT_U_T.18(Y13)
MT_TS_J: MT_R_TJ.1 MT_RT_TJ.2 MT_U_T.17(Y14)
MT_TS_K: MT_R_TK.1 MT_RT_TK.2
MT_VDDA_T: C_vdd_ts_a.1 MT_L_TA.1 MT_R_TA.2 MT_R_TB.2 MT_R_TC.2 MT_R_TD.2 MT_R_TE.2 MT_R_TG.2 MT_R_TJ.2 MT_R_TK.2
MT_VSSA: MT_R_FV.1 MT_RT_TA.1 MT_RT_TB.1 MT_RT_TC.1 MT_RT_TD.1 MT_RT_TE.1 MT_RT_TG.1 MT_RT_TJ.1 MT_RT_TK.1
NC4: MT_C_HK.2 MT_U_H.23(NC4) Rnc4.1
nRST: MT_C_HJ.2 MT_U_B.10(PGD) MT_U_H.1(RST) R26.1
OVS: MT_U_B.16(OVS) Rovs.1
PAN_DET: D_1A.1(K) D_1B.1(K) MT_U_T.23(Y8) Q_LEDVSS.1(G)
PM: MT_U_H.28(PM) Rpm.2
PM_OUT: MT_U_H.11(PM_OUT)
POLARITY: MT_U_T.2(Y7) Q_LEDA.3(D) Q_LEDB.1(G) R_LED_B.1 R_LED_D.1
SIA: MT_U_B.1(SIA) Riinsns1.1
SIB: MT_U_B.14(SIB) Rioutsns1.1
SOA: MT_U_B.2(SDA) Riinsns2.1
SOB: MT_U_B.13(SOB) Rioutsns2.1
SOL_1A: J1.1 J1.2 J1.3 J1.4 J1.5 J1.6 J1.7 J1.8 MT_D_IN_A.2(A) MT_D_IN_B.1(K) MT_D_IN_E.2(A) MT_D_IN_F.1(K) MT_D_IN_I.2(A) MT_D_IN_J.1(K) MT_D_IN_M.2(A) MT_D_IN_N.1(K) MT_D_IN_Q.2(A) MT_D_IN_R.1(K) MT_D_IN_U.2(A) MT_D_IN_V.1(K) MT_KA.3(COM1) R_1A_a.1
SOL_1B: J2.1 J2.2 J2.3 J2.4 J2.5 J2.6 J2.7 J2.8 MT_D_IN_C.2(A) MT_D_IN_D.1(K) MT_D_IN_G.2(A) MT_D_IN_H.1(K) MT_D_IN_K.2(A) MT_D_IN_L.1(K) MT_D_IN_O.2(A) MT_D_IN_P.1(K) MT_D_IN_S.2(A) MT_D_IN_T.1(K) MT_D_IN_W.2(A) MT_D_IN_X.1(K) MT_KA.6(COM2) R_1B_a.1
SOL_V_N: MT_KA.4(NO1) MT_KA.7(NC2) MT_KB.3(COM1)
SOL_V_P: MT_KA.2(NC1) MT_KA.5(NO2) MT_KB.6(COM2) MT_KB.7(NC2)
SW1: C18.2 Cboot1.1 Dbg1.1(K) Dtg1.2(A) L1.1 L2.1 L3.1 L4.1 L5.1 L6.1 L7.1 L8.1 L9.1 L10.1 L11.1 L12.1 MT_Q1.3(S) MT_Q2.2(D) MT_U_B.28(HSA) Rtg1s.1
SW2: C19.2 Cboot2.1 Dbg2.1(K) Dtg2.2(A) L1.2 L2.2 L3.2 L4.2 L5.2 L6.2 L7.2 L8.2 L9.2 L10.2 L11.2 L12.2 MT_Q3.2(D) MT_Q4.3(S) MT_U_B.18(HSB) Rtg2s.2
TG1: D3.1(K) MT_U_B.27(HOA) Rtg1a.1
TG2: D4.1(K) MT_U_B.19(HOB) Rtg2a.2
TWLV_FB: TWLV_R_C.2 TWLV_R_D.2 U_TWLV_A.4(FB)
WAKEUP_R: TWLV_Q_A.1(G) TWLV_R_B.1
NetC18_1: C18.1 D15.2(A) R110.2
NetC19_1: C19.1 D14.2(A) R140.2
NetC49_2: C49.2 MT_U_H.14(A0) R28.1 R38.2
NetC50_2: C50.2 MT_U_H.16(A2) R29.1 R39.2
NetC51_2: C51.2 MT_U_H.18(A4) R30.2 R40.2
NetC52_1: C52.1 MT_U_H.20(A6) R31.1 R41.2
NetCsu1_2: Csu1.2 Qsu.1(B) Rsu2.1 Rsu3.1 Rsu4.1
NetD3_2: D3.2(A) MT_Q1.1(G) Rtg1a.2 Rtg1s.2
NetD4_2: D4.2(A) MT_Q4.1(G) Rtg2a.1 Rtg2s.1
NetD5_2: D5.2(A) MT_Q2.1(G) Rbg1a.2 Rbg1s.2
NetD6_2: D6.2(A) MT_Q3.1(G) Rbg2a.1 Rbg2s.1
NetD_CLAMP_1_2: D_CLAMP_1.2(A) D_CLAMP_2.1(K)
NetD_CLAMP_2_2: D_CLAMP_2.2(A) D_CLAMP_3.1(K)
NetD_CLAMP_3_2: D_CLAMP_3.2(A) D_CLAMP_4.1(K)
NetD_CLAMP_4_2: D_CLAMP_4.2(A) D_CLAMP_5.1(K)
NetD_CLAMP_5_2: D_CLAMP_5.2(A) D_CLAMP_6.1(K)
NetD_CLAMP_6_2: D_CLAMP_6.2(A) D_CLAMP_7.1(K)
NetD_CLAMP_7_2: D_CLAMP_7.2(A) D_CLAMP_8.1(K)
NetD_CLAMP_9_2: D_CLAMP_9.2(A) D_CLAMP_10.1(K)
NetD_CLAMP_11_2: D_CLAMP_11.2(A) D_CLAMP_12.1(K)
NetD_CLAMP_12_2: D_CLAMP_12.2(A) D_CLAMP_13.1(K)
NetD_CLAMP_13_2: D_CLAMP_13.2(A) D_CLAMP_14.1(K)
NetD_CLAMP_14_2: D_CLAMP_14.2(A) D_CLAMP_15.1(K)
NetD_CLAMP_15_2: D_CLAMP_15.2(A) D_CLAMP_16.1(K)
NetD_CLAMP_16_2: D_CLAMP_16.2(A) D_CLAMP_17.1(K)
NetD_CLAMP_17_2: D_CLAMP_17.2(A) D_CLAMP_18.1(K)
NetJ1_10: J1.10 R101.2
NetJ1_12: J1.12 R100.2
NetJ2_10: J2.10 R102.2
NetJ2_12: J2.12 R103.2
NetMT_C_HB_1: MT_C_HB.1 MT_C_HC.2 MT_U_H.12(VDDA) R21.1
NetMT_C_HD_2: MT_C_HD.2 MT_U_H.5(NC2)
NetQ_LEDB_3: Q_LEDB.3(D) R_LED_A.1 R_LED_C.1
NetR_1A_a_2: R_1A_a.2 R_1A_b.1
NetR_1B_a_2: R_1B_a.2 R_1B_b.1
NetTWLV_D_A_1: TWLV_D_A.1(K) TWLV_L_A.1 U_TWLV_A.2(OUT)
NetTWLV_L_A_2: TWLV_L_A.2 TWLV_R_E.1

Not connected (* = marked no-connect by the designer): J1 S1(SHIELD) S2(SHIELD); J2 S1(SHIELD) S2(SHIELD); MT_KB 2(NC1); MT_U_B 15(OVP); MT_U_T 16(Y15)

### Notes on the sheet
- (near R28) SWAP
- (near R29) SWAP
- (near R39) DNP
- (near R40) DNP
- (near R41) DNP
- (near R38) SWAP
- Labels drawn without touching a wire or pin: MT_TS_K
- Title
- Size:
- Date:
- File:
- D
- Number:
- Time:
- Revision:
- Sheet
- of

### Library data of the parts
C C49-C52 Cvdd = CL05B104KO5NNNC: C - CAPACITOR - MLCC - 100nF - 16V - 0402; WVDC: 16; LCSC Part #: C1525; JLC Availability: Basic
C5v1 Cvcc MT_C_HJ MT_C_HK = CL05A105KA5NQNC: C - CAPACITOR - MLCC - 1uF - 25V - 0402; WVDC: 16; LCSC Part #: C52923; JLC Availability: Basic
C5v2 C_vdd_ts_a MT_C_HB MT_C_HG = CL05A106MQ5NUNC: C - CAPACITOR - MLCC - 10uF - 6.3V - 0402; WVDC: 6.3; LCSC Part #: C15525; JLC Availability: Basic
C18 C19 = 1206B102K202NT: C - CAPACITOR - MLCC - 1nF - 2000V - 1206 - X7R; WVDC: 2000; LCSC Part #: C9196; JLC Availability: Basic
Cboot1 Cboot2 = CL10B474KA8NNNC: C - CAPACITOR - MLCC - 470nF - 25V - 0603; WVDC: 25; LCSC Part #: C1623; JLC Availability: Basic
Ciin Ciout Csu1 Csu2 = 0402B102K500NT: C - CAPACITOR - MLCC - 1nF - 50V - 0402; WVDC: 50; LCSC Part #: C1523; JLC Availability: Basic
D3-D6 D_1A D_1B = N4148WS: D - DIODE - FAST TRR - 100V - 150mA - 4ns; LCSC Part #: C2128; JLC Availability: Basic; PIV: 100V; If: 150mA; Trr: 4ns
D14 D15 Dbg1 Dbg2 Dtg1 Dtg2 MT_D_IN_A MT_D_IN_B MT_D_IN_C MT_D_IN_D MT_D_IN_E MT_D_IN_F MT_D_IN_G MT_D_IN_H MT_D_IN_I MT_D_IN_J MT_D_IN_K MT_D_IN_L MT_D_IN_M MT_D_IN_N MT_D_IN_O MT_D_IN_P MT_D_IN_Q MT_D_IN_R MT_D_IN_S MT_D_IN_T MT_D_IN_U MT_D_IN_V MT_D_IN_W MT_D_IN_X TWLV_D_A = SS210: D - DIODE - SCHOTTKY - 100V - 2A; Vrrm: 100; If: 2A; LCSC Part #: C14996; JLC Availability: Extended
D_1A_G D_1B_G D_CLAMP_1-D_CLAMP_18 = ZMM5V6-M: D - DIODE - ZENER - 5.6V - 500mW; LCSC Part #: C8062; JLC Availability: BASIC
Dsu1 Dsu2 = 1N5819WS: D - DIODE - SCHOTTKY - 40V - 1A; Trr: 4ns; LCSC Part #: C191023; JLC Availability: Basic; PIV: 40V; If: 1A
J1 J2 = 2-406549-1: J - JACK - ETHERNET - Right - THT; LCSC Part #: C125068; JLC Availability: Extended
L1-L12 TWLV_L_A = SWRB1207S-221MT: L - INDUCTOR - 220uH - 1.6A - 12.5mm; Isat: 1.6A; LCSC Part #: C169380; JLC Availability: Extended
MT_C_AA MT_C_AB MT_C_AC MT_C_AD MT_C_AE MT_C_AF MT_C_AG MT_C_AH MT_C_AI MT_C_AJ MT_C_AK MT_C_AL MT_C_AM MT_C_AN MT_C_BA MT_C_BB MT_C_BC MT_C_BD MT_C_BE MT_C_BF MT_C_BG MT_C_BH MT_C_BI MT_C_BJ MT_C_BK MT_C_BL MT_C_CA MT_C_CB MT_C_CC MT_C_CD MT_C_CE MT_C_CF MT_C_CG MT_C_CH MT_C_CI MT_C_CJ MT_C_CK MT_C_CL MT_C_CM MT_C_CN MT_C_DA MT_C_DB MT_C_DC MT_C_DD MT_C_DE MT_C_DF MT_C_DG MT_C_DH MT_C_DI MT_C_DJ MT_C_DK MT_C_DL MT_C_EA MT_C_EB MT_C_EC MT_C_ED MT_C_EE MT_C_EF MT_C_EG MT_C_EH MT_C_EI MT_C_EJ MT_C_EK MT_C_EL MT_C_FA MT_C_FB MT_C_FC MT_C_FD MT_C_FE MT_C_FF MT_C_FG MT_C_FH MT_C_FI MT_C_FJ MT_C_FK MT_C_FL TWLV_C_DA TWLV_C_DB TWLV_C_DC TWLV_C_DD = 1206B105K101NT: C - CAPACITOR - MLCC - 1uF - 100V - 1206 - X7R; WVDC: 100; LCSC Part #: C91151; JLC Availability: Extended
MT_C_HA MT_C_HC MT_C_HI MT_C_HL = CL05B103KB5NNNC: C - CAPACITOR - MLCC - 10nF - 50V - 0402; WVDC: 50; LCSC Part #: C15195; JLC Availability: Basic
MT_C_HD MT_C_HE MT_C_HF MT_R_TA MT_R_TB MT_R_TC MT_R_TD MT_R_TE MT_R_TG MT_R_TJ MT_R_TK R26 Rbg1s Rbg2s Rovs Rscl Rsda Rtg1s Rtg2s TWLV_R_B = 0402WGF1002TCE: R - RESISTOR - SMD - 10k - 1% - 0402; LCSC Part #: C25744; JLC Availability: Basic
MT_D_KA MT_D_KB = 1N4148WS: D - DIODE - FAST TRR - 100V - 150mA - 4ns; LCSC Part #: C2128; JLC Availability: Basic; PIV: 100V; If: 150mA; Trr: 4ns
MT_KA MT_KB = G2RL-2-DC12: SW - Relay 12VDC 8A DPDT (( 29mm 12.7mm 15.7mm)) THT; Coil: 12V; MF: Omron; MP: G2RL-2-DC12; Current: 8A; Availability: Extended; Value: *; Type: DPDT; LCSC Part #: C61458
MT_L_TA = SDFL1608S100KTF: L - INDUCTOR - 10uH - 0603; LCSC Part #: C1035; JLC Availability: Basic
MT_NT_A = NET_TIE: R - Net Tie
MT_Q1-MT_Q4 = CRSS042N10N: Q - TRANSISTOR - MOSFET (N) - 100V - 120A - 0.005R; WVDC: 100; LCSC Part #: C410926; JLC Availability: Extended
MT_Q_KA MT_Q_KB Q_LEDA Q_LEDB Q_LEDVSS Qscl Qsda TWLV_Q_A = 2N7002: Q - TRANSISTOR - MOSFET (N) - 60V - 200mW; WVDC: 60; JLC Availability: Basic; LCSC Part #: C8545
MT_R_FT MT_R_FV R29-R31 R160 R_LED_A R_LED_B R_LED_C R_LED_D Ragnd TWLV_R_F = 0402WGF0000TCE: R - RESISTOR - SMD - 0R - 1% - 0402; LCSC Part #: C17168; JLC Availability: Basic
MT_R_TW MT_R_TX MT_R_TY MT_R_TZ = 0402WGF5101TCE: R - RESISTOR - SMD - 5.1k - 1% - 0402; LCSC Part #: C25905; JLC Availability: Basic
MT_RT_TA MT_RT_TB MT_RT_TC MT_RT_TD MT_RT_TE MT_RT_TG MT_RT_TJ MT_RT_TK = NCP15XH103F03RC: RT - NTC THERMISTOR - 10k - 1% - 0402; Value2: 3380k; LCSC Part #: C77131; JLC Availability: Extended
MT_U_B = SM72295: Photovoltaic Full Bridge Driver; Manufacturer: National Semiconductor; PackageTopMarking: S13051; ComponentLink1Description: Solar Magic Website; ComponentLink1URL: http://www.solarmagic.com; CompType: Driver; PackageReference: M28B_N; PartNumber: SM72295; RoHS: Y; PinCount: 28; PackageDescription: SOIC-28
MT_U_H = SM72442: Programmable Maximum Power Point Tracking Controller for Photovoltaic Solar Panels; Manufacturer: National Semiconductor; CompType: MPPT Controller; PackageTopMarking: S02442; RoHS: Y; PartNumber: SM72442; PackageReference: MTC28_L; ComponentLink1Description: Solar Magic Website; ComponentLink1URL: http://www.solarmagic.com; PackageDescription: TSSOP-28; PinCount: 28
MT_U_T = 74HC4067PW,118: U - IC -16 Port Analog MUX; ComponentLink1Description: Manufacturer URL; ComponentLink1URL: http://www.st.com/web/en/home.html; ComponentLink2Description: Datasheet; ComponentLink2URL: http://www.st.com/st-web-ui/static/active/en/resource/technical/document/datasheet/CD00161566.pdf; ComponentLink3Description: Package Specification; ComponentLink3URL: http://www.st.com/st-web-ui/static/active/en/resource/technical/document/datasheet/DM00058181.pdf; JLC Availability: Extended; LCSC Part #: C179326
Qsu = MMBT3904: Q - TRANSISTOR - BJT - NPN - 40V 200mA; JLC Availability: Basic; LCSC Part #: C20526
R1 R10 = FMF25FPJR005-LH: R - RESISTOR - SMD - 0.005R - 1% - 2512 - 2W; LCSC Part #: C371096; JLC Availability: Extended; ComponentLink1URL: http://riedon.com/media/pdf/CSR.pdf; ComponentLink1Description: http://riedon.com/media/pdf/CSR.pdf; Power: 2W
R21 = 0402WGF470JTCE: R - RESISTOR - SMD - 47R - 1% - 0402; LCSC Part #: C25118; JLC Availability: Basic
R28 = 0402WGF3302TCE: R - RESISTOR - SMD - 33k - 1% - 0402; LCSC Part #: C25779; JLC Availability: Basic
R38 = 0402WGF4701TCE: R - RESISTOR - SMD - 4.7k - 1% - 0402; LCSC Part #: C25900; JLC Availability: Basic
R39-R41 TWLV_R_A = 0402WGF1004TCE: R - RESISTOR - SMD - 1M - 1% - 0402; LCSC Part #: C26083; JLC Availability: Basic
R100-R103 = 0402WGF1000TCE: R - RESISTOR - SMD - 100R - 1% - 0402; LCSC Part #: C25076; JLC Availability: Basic
R110 R140 = 1206W4F100JT5E: R - RESISTOR - SMD - 10R - 1% - 1206; LCSC Part #: C17903; JLC Availability: Basic
R_1A_a R_1A_b R_1B_a R_1B_b = 0402WGF4702TCE: R - RESISTOR - SMD - 47k - 1% - 0402; LCSC Part #: C25792; JLC Availability: Basic
R_1A_c R_1B_c Rsu1 = 0402WGF1003TCE: R - RESISTOR - SMD - 100k - 1% -  0402; LCSC Part #: C25741; JLC Availability: Basic
Rbg1a Rbg2a Rtg1a Rtg2a = 0603WAF100KT5E: R - RESISTOR - SMD - 1R - 1% -  0603; LCSC Part #: C22936; JLC Availability: Basic
Rbin Rbout = 0402WGF100JTCE: R - RESISTOR - SMD - 10R - 1% - 0402; LCSC Part #: C25077; JLC Availability: Basic
Riin Riout Rnc4 Rpm = 0402WGF5602TCE: R - RESISTOR - SMD - 56k - 1% - 0402; LCSC Part #: C25796; JLC Availability: Basic
Riinsns1 Riinsns2 Rioutsns1 Rioutsns2 = 0603WAF6800T5E: R - RESISTOR - SMD - 680R - 1% - 0603; LCSC Part #: C23228; JLC Availability: Basic
Rsu2 Rsu3 = 0603WAF2703T5E: R - RESISTOR - SMD - 270k - 1% - 0603; LCSC Part #: C22965; JLC Availability: Basic
Rsu4 = 0402WGF3303TCE: R - RESISTOR - SMD - 330k - 1% - 0402; LCSC Part #: C25778; JLC Availability: Basic
Rsu5 = 0402WGF1001TCE: R - RESISTOR - SMD - 1k - 1% - 0402; LCSC Part #: C11702; JLC Availability: Basic
Rvinb Rvoutb = 0603WAF1002T5E: R - RESISTOR - SMD - 10k - 1% - 0603; LCSC Part #: C25804; JLC Availability: Basic
Rvint Rvoutt = 0603WAF100KT5E: R - RESISTOR - SMD - 100k - 1% -  0603; LCSC Part #: C22936; JLC Availability: Basic
TWLV_C_AA TWLV_C_AB TWLV_C_AC TWLV_C_AD TWLV_C_AE TWLV_C_AF TWLV_C_AG TWLV_C_AH TWLV_C_AI TWLV_C_AJ TWLV_C_AK TWLV_C_AL TWLV_C_AM TWLV_C_AN TWLV_C_AO TWLV_C_AP TWLV_C_AQ TWLV_C_AR TWLV_C_AS TWLV_C_AT TWLV_C_AU TWLV_C_AV TWLV_C_AW TWLV_C_AX TWLV_C_AY TWLV_C_AZ TWLV_C_BA TWLV_C_BB TWLV_C_BC TWLV_C_BD TWLV_C_BE TWLV_C_BF TWLV_C_BG TWLV_C_BH TWLV_C_BI TWLV_C_BJ = CL10A106MA8NRNC: C - CAPACITOR - MLCC - 10uF - 25V - 0603; WVDC: 25; LCSC Part #: C96446; Availability: Basic
TWLV_R_C = 0402WGF1201TCE: R - RESISTOR - SMD - 1.2k - 1% - 0402; LCSC Part #: C25862; JLC Availability: Basic
TWLV_R_D = 0603WAF3900T5E: R - RESISTOR - SMD - 390R - 1% - 0603; LCSC Part #: C23151; JLC Availability: Basic
TWLV_R_E = 1206W4F100LT5E: R - RESISTOR - SMD - 0.1R - 1% - 1206; LCSC Part #: C25334; JLC Availability: Basic
U5V2 = 78L05G-AB3-R: U - IC - 5V Power Regulator; VOut: 5.0; LCSC Part #: C71136; JLC Availability: Basic
U_TWLV_A = LM2576HVS-ADJ/TR: U - IC - BUCK CONVERTER, ADJUSTABLE, 60V, 3A; MF: Texas Instruments; Package: TO-263-5; Availability: Extended; Value: *; LCSC Part #: C234208; Texas_Instruments-Purchase-URL: https://snapeda.com/shop?store=Texas+Instruments&id=213619